# Altium project PulseOxLabView.PrjPcb
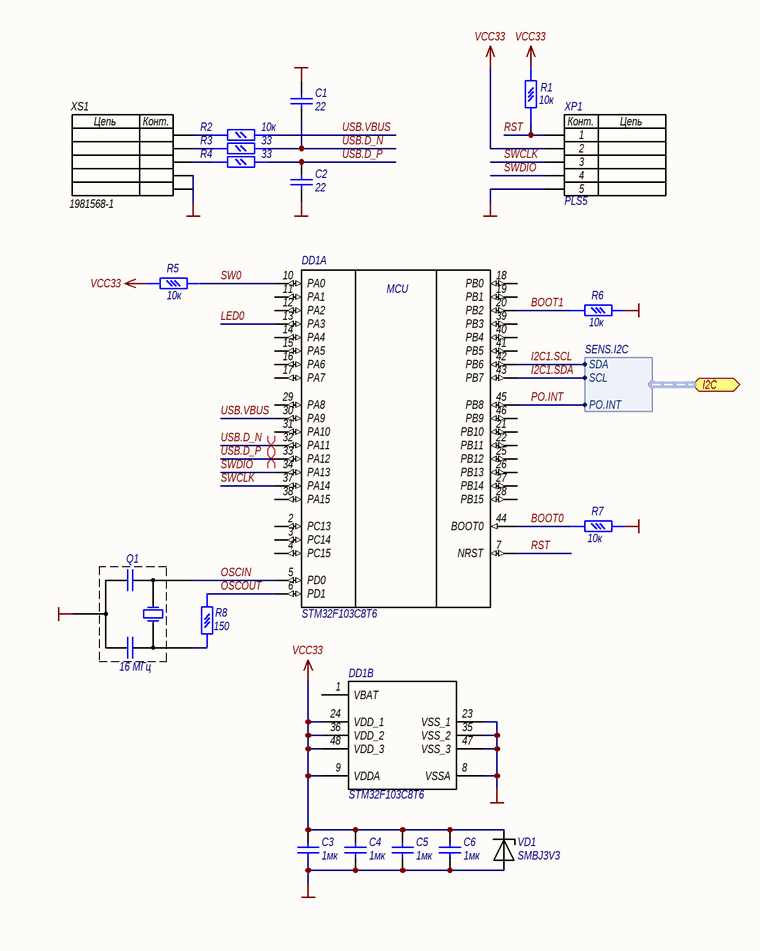
[diagram p0: MCU.SchDoc]
3 sheets, 49 parts. Net scope: flat (ports and power ports of the same name join across sheets).
Sheets:
  MCU.SchDoc
  Power.SchDoc
  Sensors.SchDoc

## Sheet MCU.SchDoc: {Наименование}
size 209 x 297 mm; DocumentNumber: {Обозначение}; SheetNumber: {}; SheetTotal: {}; PageSetup: Record=PageOptions|CenterHorizontal=False|CenterVertical=False|PrintScale=0.99|XCorrection=0.00|YCorrection=0.00|PrintKind=1|BorderSize=5000000|LeftOffset=0|BottomOffset=0|Orientation=1|PaperLength=1000|PaperWidth=1000|Scale=100|PaperSource=15|PrintQuality=600|MediaType=1|DitherType=10|PrintScaleMode=1|PaperKind=A4; Rule: PcbType=ProtelPcb

### Parts
C1  value 22  [CAPC2012L]  (hidden comment: CL21C220JBANNN)
C2  value 22  [CAPC2012L]  (hidden comment: CL21C220JBANNN)
C3  value 1мк  [CAPC1608L]  (hidden comment: CL10A105KO5LNN)
C4  value 1мк  [CAPC1608L]  (hidden comment: CL10A105KO5LNN)
C5  value 1мк  [CAPC1608L]  (hidden comment: CL10A105KO5LNN)
C6  value 1мк  [CAPC1608L]  (hidden comment: CL10A105KO5LNN)
DD1  STM32F103C8T6  [STM-LQFP48_N]  (parts A,B of 2)
Q1  value 16 МГц  [CSTCE_V1]  (hidden comment: CSTCE16M0V53A)
R1  value 10к  [RESC1608L]  (hidden comment: RC1608J103CS)
R2  value 10к  [RESC2012L]  (hidden comment: RC2012J103CS)
R3  value 33  [RESC2012L]  (hidden comment: RC2012J330CS)
R4  value 33  [RESC2012L]  (hidden comment: RC2012J330CS)
R5  value 10к  [RESC1608L]  (hidden comment: RC1608J103CS)
R6  value 10к  [RESC1608L]  (hidden comment: RC1608J103CS)
R7  value 10к  [RESC1608L]  (hidden comment: RC1608J103CS)
R8  value 150  [RESC1608L]  (hidden comment: RC1608J151CS)
VD1  SMBJ3V3  [SMB]
XP1  PLS5  [hdr1x5]
XS1  1981568-1  [1981568]

### Ports
I2C (harness SENS.I2C)

### Harnesses
SENS.I2C: SDA, SCL, PO.INT

### Nets
GND: C1.2 C2.2 C3.1 C4.1 C5.1 C6.1 DD1.8(VSSA) DD1.23(VSS_1) DD1.35(VSS_2) DD1.47(VSS_3) Q1.2(GND) R6.1 R7.1 VD1.2(A) XP1.5 XS1.4 XS1.5
VCC33: C3.2 C4.2 C5.2 C6.2 DD1.9(VDDA) DD1.24(VDD_1) DD1.36(VDD_2) DD1.48(VDD_3) R1.2 R5.1 VD1.1(C) XP1.2
BOOT0: DD1.44(BOOT0) R7.2
BOOT1: DD1.20(PB2) R6.2
I2C1.SCL: DD1.42(PB6) ; port I2C.SDA  [project net I2C.SDA]
I2C1.SDA: DD1.43(PB7) ; port I2C.SCL  [project net I2C.SCL]
LED0: DD1.13(PA3)
OSCIN: DD1.5(PD0) Q1.1(OSC1)
OSCOUT: DD1.6(PD1) R8.2
PO.INT: DD1.45(PB8) ; port I2C.PO.INT
RST: DD1.7(NRST) R1.1 XP1.1
SW0: DD1.10(PA0) R5.2
SWCLK: DD1.37(PA14) XP1.3
SWDIO: DD1.34(PA13) XP1.4
USB.D_N: C1.1 DD1.32(PA11) R3.2
USB.D_P: C2.1 DD1.33(PA12) R4.2
USB.VBUS: DD1.30(PA9) R2.2
NetQ1_3: Q1.3(OSC2) R8.1
NetR2_1: R2.1 XS1.1
NetR3_1: R3.1 XS1.2
NetR4_1: R4.1 XS1.3

Not connected (* = marked no-connect by the designer): DD1 1(VBAT) 2(PC13) 3(PC14) 4(PC15) 11(PA1) 12(PA2) 14(PA4) 15(PA5) 16(PA6) 17(PA7) 18(PB0) 19(PB1) 21(PB10) 22(PB11) 25(PB12) 26(PB13) 27(PB14) 28(PB15) 29(PA8) 31(PA10) 38(PA15) 39(PB3) 40(PB4) 41(PB5) 46(PB9)

### Layout directives
differential pair: USB.D_N, USB.D_P

### Notes on the sheet
- Подп. и дата
- Инв. № дубл.
- Взам. инв. №
- Инв. № подл.
- Лист
- Изм.
- № докум.
- Подп.
- Дата
- (in symbol MICRO USB B) Цепь; Конт.
- (in symbol PLS5) Конт.; Цепь
- (in symbol STM32F103C8T6, part A) MCU

### Library data of the parts
C1 C2 = CL21: Samsung General Capacitor; Power/Voltage: 25В; Rem: SMD; ТКЕ/ТКС: NP0; Tolerance: ±5%; TU/GOST: EIA CC0805; PackageReference: 0805; ManufacturerPartNumber: CL21C220JBANNN; Manufacturer: Samsung; Range: *
C3-C6 = CL10A105KO5LNN: Samsung MLCC Capacitor; Power/Voltage: 16В; Rem: SMD; Tolerance: ±10%; TU/GOST: EIA CC0603; ТКЕ/ТКС: X5R; VAL: 105; Designator: C?; Manufacturer: Samsung; ManufacturerPartNumber: CL10A105KO5LNN; PackageReference: 0603; Range: *; Part Number: CL10A105KO5LNN; Pin Count: 2; Published: 01.05.2013; Publisher: Komiss Labs.
DD1 = STM32F103C8T6: ARM Cortex-M3 32-bit MCU, 64 KB Flash, 20 KB Internal RAM, 37 I/Os, 48-pin LQFP, -40 to 85 degC, Tray; Manufacturer: STMicroelectronics; REM: SMD; ManufacturerPartNumber: STM32F103C8T6; PackageReference: LQFP48
Q1 = CSTCE16M0V53A: Murata Ceramic Resonator; Manufacturer: Murata Manufacturing Co., Ltd.; ManufacturerPartNumber: CSTCE16M0V53A; PackageReference: 3216
R1 R5-R7 = RC1608J103CS: General Thick Film Chip Resistor; Manufacturer: Samsung; Power/Voltage: 0.1Вт; Tolerance: ±5%; Rem: SMD; Check: NO; ТКЕ/ТКС: ±250ppm/°C; TU/GOST: EIA RES0603; Designator: R?; F47: 10000,0; ManufacturerPartNumber: RC1608J103CS; PackageReference: 0603; Name: RC1608J103CS; Type: Резистор; Part Number: RC1608J103CS; Pin Count: 2; Published: 01.05.2013; Publisher: Komiss Labs.
R2-R4 = RES0805: Thick Film Chip Resistor; Manufacturer: Samsung; Power/Voltage: 150В/0.125Вт; Tolerance: ±5%; Rem: SMD; Check: NO; PackageReference: 0805
  R2: ManufacturerPartNumber: RC2012J103CS
  R3 R4: ManufacturerPartNumber: RC2012J330CS
R8 = RC1608J151CS: General Thick Film Chip Resistor; Manufacturer: Samsung; Power/Voltage: 0.1Вт; Tolerance: ±5%; Rem: SMD; Check: NO; ТКЕ/ТКС: ±250ppm/°C; TU/GOST: EIA RES0603; Designator: R?; F47: 150,0; ManufacturerPartNumber: RC1608J151CS; PackageReference: 0603; Name: RC1608J151CS; Type: Резистор; Part Number: RC1608J151CS; Pin Count: 2; Published: 01.05.2013; Publisher: Komiss Labs.
VD1 = SMAJ58A: TVS UNIDIRECT 600W 3.3V SMB; Manufacturer: Diodes Inc; Type: Стабилитрон; ManufacturerPartNumber: SMBJ3V3; PackageReference: SMB(DO-214AA)
XS1 = MICRO USB B: CONN RCPT MICRO USB B R/A SMD; Manufacturer: TE Connectivity; ManufacturerPartNumber: 1981568-1; Type: Розетка

## Sheet Power.SchDoc: {Наименование}
size 209 x 297 mm; DocumentNumber: {Обозначение}; SheetNumber: {}; SheetTotal: {}; PageSetup: Record=PageOptions|CenterHorizontal=False|CenterVertical=False|PrintScale=0.95|XCorrection=0.00|YCorrection=0.00|PrintKind=1|BorderSize=5000000|LeftOffset=0|BottomOffset=0|Orientation=1|PaperLength=1000|PaperWidth=1000|Scale=100|PaperSource=15|PrintQuality=600|MediaType=1|DitherType=10|PaperKind=A4|PrintScaleMode=1; Rule: PcbType=ProtelPcb
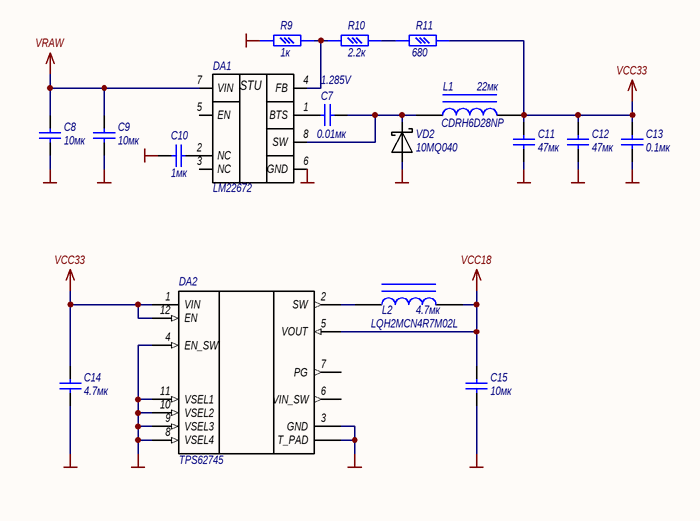
[diagram p1: Power.SchDoc]

### Parts
C7  value 0.01мк  [CAPC3216L]  (hidden comment: CL31B103KBCNNN)
C8  value 10мк  [CAPC3216L]  (hidden comment: CL31A106KBHNNN)
C9  value 10мк  [CAPC3216L]  (hidden comment: CL31A106KBHNNN)
C10  value 1мк  [CAPC1608L]  (hidden comment: CL10A105KA5LNN)
C11  value 47мк  [CAPC3225L]  (hidden comment: CL32A476MQJNNN)
C12  value 47мк  [CAPC3225L]  (hidden comment: CL32A476MQJNNN)
C13  value 0.1мк  [CAPC3216L]  (hidden comment: CL31B104KACNNN)
C14  value 4.7мк  [CAPC1005L]  (hidden comment: CL05A475MQ5NRN)
C15  value 10мк  [CAPC1608L]  (hidden comment: CL10A106MO8NQN)
DA1  LM22672  [MRA08B_N]
DA2  TPS62745  [WSON-12]
L1  CDRH6D28NP  value 22мк  [CDRH6D38]
L2  LQH2MCN4R7M02L  value 4.7мк  [INDUCTOR0806]
R9  value 1к  [RESC1608L]  (hidden comment: RC1608J102CS)
R10  value 2.2к  [RESC1608L]  (hidden comment: RC1608J222CS)
R11  value 680  [RESC1608L]  (hidden comment: RC1608J681CS)
VD2  10MQ040  [SMA_]

### Nets
GND: C8.1 C9.1 C10.1 C11.1 C12.1 C13.1 C14.1 C15.1 DA1.6(GND) DA2.3(GND) DA2.4(EN_SW) DA2.8(VSEL4) DA2.9(VSEL3) DA2.10(VSEL2) DA2.11(VSEL1) DA2.13(T_PAD) R9.1 VD2.1
VCC18: C15.2 DA2.5(VOUT) L2.2
VCC33: C11.2 C12.2 C13.2 C14.2 DA2.1(VIN) DA2.12(EN) L1.2 R11.2
VRAW: C8.2 C9.2 DA1.7(VIN)
NetC7_1: C7.1 DA1.8(SW) L1.1 VD2.2
NetC7_2: C7.2 DA1.1(BTS)
NetC10_2: C10.2 DA1.2(NC)
NetDA1_4: DA1.4(FB) R9.2 R10.1
NetDA2_2: DA2.2(SW) L2.1
NetR10_2: R10.2 R11.1

Not connected (* = marked no-connect by the designer): DA1 3(NC) 5(EN); DA2 6(VIN_SW) 7(PG)

### Notes on the sheet
- 1.285V
- Подп. и дата
- Инв. № дубл.
- Взам. инв. №
- Инв. № подл.
- Лист
- Изм.
- № докум.
- Подп.
- Дата
- (in symbol LM2674MX-XXX) STU

### Library data of the parts
C7 = CL31B103KBCNNN: Samsung MLCC Capacitor; Power/Voltage: 50В; Rem: SMD; Tolerance: ±10%; TU/GOST: EIA CC1206; ТКЕ/ТКС: X7R; VAL: 103; Manufacturer: Samsung; ManufacturerPartNumber: CL31B103KBCNNN; PackageReference: 1206; Range: *; Part Number: CL31B103KBCNNN; Pin Count: 2; Published: 01.05.2013; Publisher: Komiss Labs.
C8 C9 = CL31A106KBHNNN: Samsung MLCC Capacitor; Power/Voltage: 50В; Rem: SMD; Tolerance: ±10%; TU/GOST: EIA CC1206; ТКЕ/ТКС: X5R; VAL: 106; Designator: C?; Manufacturer: Samsung; ManufacturerPartNumber: CL31A106KBHNNN; PackageReference: 1206; Range: *; Part Number: CL31A106KBHNNN; Pin Count: 2; Published: 01.05.2013; Publisher: Komiss Labs.
C10 = CL10A105KA5LNN: Samsung MLCC Capacitor; Power/Voltage: 25В; Rem: SMD; Tolerance: ±10%; TU/GOST: EIA CC0603; ТКЕ/ТКС: X5R; VAL: 105; Designator: C?; Manufacturer: Samsung; ManufacturerPartNumber: CL10A105KA5LNN; PackageReference: 0603; Range: *; Part Number: CL10A105KA5LNN; Pin Count: 2; Published: 01.05.2013; Publisher: Komiss Labs.
C11 C12 = CL32A476MQJNNN: Samsung MLCC Capacitor; Power/Voltage: 6.3В; Rem: SMD; Tolerance: ±20%; TU/GOST: EIA CC1210; ТКЕ/ТКС: X5R; VAL: 476; Manufacturer: Samsung; ManufacturerPartNumber: CL32A476MQJNNN; PackageReference: 1210; Range: *; Part Number: CL32A476MQJNNN; Pin Count: 2; Published: 01.05.2013; Publisher: Komiss Labs.
C13 = CL31B104KACNNN: Samsung MLCC Capacitor; Power/Voltage: 25В; Rem: SMD; Tolerance: ±10%; TU/GOST: EIA CC1206; ТКЕ/ТКС: X7R; VAL: 104; Manufacturer: Samsung; ManufacturerPartNumber: CL31B104KACNNN; PackageReference: 1206; Range: *; Part Number: CL31B104KACNNN; Pin Count: 2; Published: 01.05.2013; Publisher: Komiss Labs.
C14 = CL05A475MQ5NRN: Samsung MLCC Capacitor; Power/Voltage: 6.3В; Rem: SMD; Tolerance: ±20%; TU/GOST: EIA CC0402; ТКЕ/ТКС: X5R; VAL: 475; Designator: C?; Manufacturer: Samsung; ManufacturerPartNumber: CL05A475MQ5NRN; PackageReference: 0402; Range: *; Part Number: CL05A475MQ5NRN; Pin Count: 2; Published: 01.05.2013; Publisher: Komiss Labs.
C15 = CL10A106MO8NQN: Samsung MLCC Capacitor; Power/Voltage: 16В; Rem: SMD; Tolerance: ±20%; TU/GOST: EIA CC0603; ТКЕ/ТКС: X5R; VAL: 106; Designator: C?; Manufacturer: Samsung; ManufacturerPartNumber: CL10A106MO8NQN; PackageReference: 0603; Range: *; Part Number: CL10A106MO8NQN; Pin Count: 2; Published: 01.05.2013; Publisher: Komiss Labs.
DA1 = LM2674MX-XXX: 40 V, 0.5A Simple Switcher, Step-Down; Manufacturer: Texas Instruments; ManufacturerPartnumber: LM22672; packagereference: SOIC-8
DA2 = TPS62745: Dual-cell Ultra Low IQ Step Down Converter for Low Power Wireless  Applications; Manufacturer: Texas Instruments; REM: SMD; ManufacturerPartNumber: TPS62745; PackageReference: WSON-12
L1 = Inductor Iron: Magnetic-Core Inductor; Manufacturer: Sumida; ManufacturerPartNumber: CDRH6D28NP-220NC; Rem: SMD; Tolerance: ±10%; Published: 24-Mar-1999; LatestRevisionDate: 17-Jul-2002; LatestRevisionNote: Re-released for DXP Platform.; PackageReference: AXIAL-0.9; Publisher: Altium Limited
L2 = Inductor Iron: Magnetic-Core Inductor; Manufacturer: Sumida; Rem: SMD; Tolerance: ±10%; Published: 24-Mar-1999; LatestRevisionDate: 17-Jul-2002; LatestRevisionNote: Re-released for DXP Platform.; PackageReference: AXIAL-0.9; Publisher: Altium Limited; ManufacturerPartNumber: LQH2MCN4R7M02L
R9 = RC1608J102CS: General Thick Film Chip Resistor; Manufacturer: Samsung; Power/Voltage: 0.1Вт; Tolerance: ±5%; Rem: SMD; Check: NO; ТКЕ/ТКС: ±250ppm/°C; TU/GOST: EIA RES0603; Designator: R?; F47: 1000,0; ManufacturerPartNumber: RC1608J102CS; PackageReference: 0603; Name: RC1608J102CS; Type: Резистор; Part Number: RC1608J102CS; Pin Count: 2; Published: 01.05.2013; Publisher: Komiss Labs.
R10 = RC1608J222CS: General Thick Film Chip Resistor; Manufacturer: Samsung; Power/Voltage: 0.1Вт; Tolerance: ±5%; Rem: SMD; Check: NO; ТКЕ/ТКС: ±250ppm/°C; TU/GOST: EIA RES0603; Designator: R?; F47: 2200,0; ManufacturerPartNumber: RC1608J222CS; PackageReference: 0603; Name: RC1608J222CS; Type: Резистор; Part Number: RC1608J222CS; Pin Count: 2; Published: 01.05.2013; Publisher: Komiss Labs.
R11 = RC1608J681CS: General Thick Film Chip Resistor; Manufacturer: Samsung; Power/Voltage: 0.1Вт; Tolerance: ±5%; Rem: SMD; Check: NO; ТКЕ/ТКС: ±250ppm/°C; TU/GOST: EIA RES0603; Designator: R?; F47: 680,0; ManufacturerPartNumber: RC1608J681CS; PackageReference: 0603; Name: RC1608J681CS; Type: Резистор; Part Number: RC1608J681CS; Pin Count: 2; Published: 01.05.2013; Publisher: Komiss Labs.
VD2 = 10MQ040: Schottky Barrier Diode; Manufacturer: International Rectifier; PackageReference: SMA(D-64); ManufacturerPartNumber: 10MQ040

## Sheet Sensors.SchDoc: {Наименование}
size 209 x 297 mm; DocumentNumber: {Обозначение}; SheetNumber: {}; SheetTotal: {}; PageSetup: Record=PageOptions|CenterHorizontal=False|CenterVertical=False|PrintScale=0.99|XCorrection=0.00|YCorrection=0.00|PrintKind=2|BorderSize=5000000|LeftOffset=0|BottomOffset=0|Orientation=1|PaperLength=1000|PaperWidth=1000|Scale=100|PaperSource=15|PrintQuality=-3|MediaType=1|DitherType=10|PrintScaleMode=1|PaperKind=A4|PaperIndex=9; Rule: PcbType=ProtelPcb
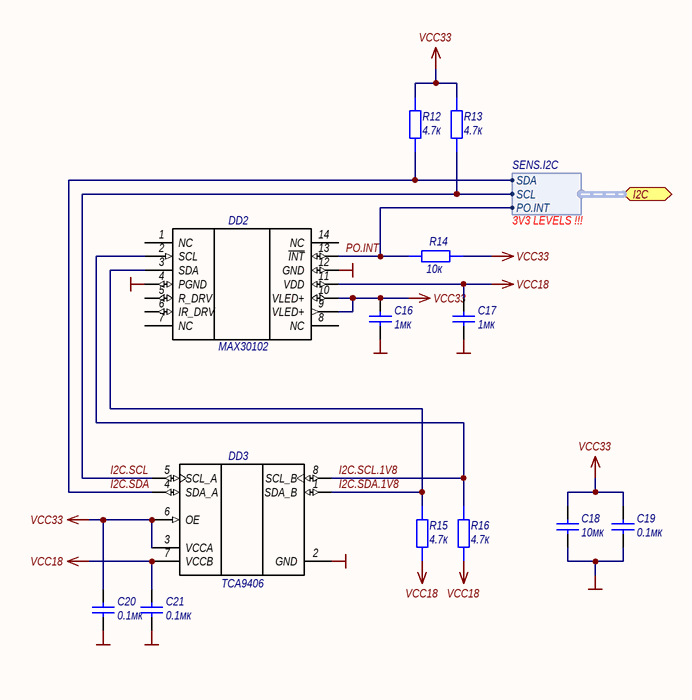
[diagram p2: Sensors.SchDoc]

### Parts
C16  value 1мк  [CAPC1005L]  (hidden comment: CL05A105KQ5NNN)
C17  value 1мк  [CAPC1005L]  (hidden comment: CL05A105KQ5NNN)
C18  value 10мк  [CAPC1005L]  (hidden comment: CL05A106MQ5NUN)
C19  value 0.1мк  [CAPC1005L]  (hidden comment: CL05A104KP5NNN)
C20  value 0.1мк  [CAPC1005L]  (hidden comment: CL05A104KP5NNN)
C21  value 0.1мк  [CAPC1005L]  (hidden comment: CL05A104KP5NNN)
DD2  MAX30102  [MAX30102]
DD3  TCA9406  [DCU8_L]
R12  value 4.7к  [RESC1005L]  (hidden comment: RC1005J472CS)
R13  value 4.7к  [RESC1005L]  (hidden comment: RC1005J472CS)
R14  value 10к  [RESC1005L]  (hidden comment: RC1005J103CS)
R15  value 4.7к  [RESC1005L]  (hidden comment: RC1005J472CS)
R16  value 4.7к  [RESC1005L]  (hidden comment: RC1005J472CS)

### Ports
I2C (harness SENS.I2C)

### Harnesses
SENS.I2C: SDA, SCL, PO.INT

### Nets
GND: C16.1 C17.1 C18.1 C19.1 C20.1 C21.1 DD2.4(PGND) DD2.12(GND) DD3.2(GND)
VCC18: C17.2 C21.2 DD2.11(VDD) DD3.7(VCCB) R15.1 R16.1
VCC33: C16.2 C18.2 C19.2 C20.2 DD2.9(VLED+) DD2.10(VLED+) DD3.3(VCCA) DD3.6(OE) R12.2 R13.2 R14.1
I2C.SCL: DD3.5(SCL_A) R13.1 ; port I2C.SCL
I2C.SCL.1V8: DD2.2(SCL) DD3.8(SCL_B) R16.2
I2C.SDA: DD3.4(SDA_A) R12.1 ; port I2C.SDA
I2C.SDA.1V8: DD2.3(SDA) DD3.1(SDA_B) R15.2
PO.INT: DD2.13(~{INT}) R14.2 ; port I2C.PO.INT

Not connected (* = marked no-connect by the designer): DD2 1(NC) 5(R_DRV) 6(IR_DRV) 7(NC) 8(NC) 14(NC)

### Notes on the sheet
- 3V3 LEVELS !!!
- Подп. и дата
- Инв. № дубл.
- Взам. инв. №
- Инв. № подл.
- Лист
- Изм.
- № докум.
- Подп.
- Дата

### Library data of the parts
C16 C17 = CL05A105KQ5NNN: Samsung MLCC Capacitor; Power/Voltage: 6.3В; Rem: SMD; Tolerance: ±10%; TU/GOST: EIA CC0402; ТКЕ/ТКС: X5R; VAL: 105; Manufacturer: Samsung; ManufacturerPartNumber: CL05A105KQ5NNN; PackageReference: 0402; Range: *; Part Number: CL05A105KQ5NNN; Pin Count: 2; Published: 01.05.2013; Publisher: Komiss Labs.
C18 = CL05A106MQ5NUN: Samsung MLCC Capacitor; Power/Voltage: 6.3В; Rem: SMD; Tolerance: ±20%; TU/GOST: EIA CC0402; ТКЕ/ТКС: X5R; VAL: 106; Manufacturer: Samsung; ManufacturerPartNumber: CL05A106MQ5NUN; PackageReference: 0402; Range: *; Part Number: CL05A106MQ5NUN; Pin Count: 2; Published: 01.05.2013; Publisher: Komiss Labs.
C19-C21 = CL05A104KP5NNN: Samsung MLCC Capacitor; Power/Voltage: 10В; Rem: SMD; Tolerance: ±10%; TU/GOST: EIA CC0402; ТКЕ/ТКС: X5R; VAL: 104; Manufacturer: Samsung; ManufacturerPartNumber: CL05A104KP5NNN; PackageReference: 0402; Range: *; Part Number: CL05A104KP5NNN; Pin Count: 2; Published: 01.05.2013; Publisher: Komiss Labs.
DD2 = MAX30102: High-Sensitivity Pulse Oximeter and  Heart-Rate Sensor for Wearable Health; Manufacturer: MAXIM Integrated; REM: SMD; ManufacturerPartNumber: MAX30102; PackageReference: LGA-14
DD3 = TCA9406: TCA9406 Dual Bidirectional 1-MHz I2C-BUS and SMBus Voltage Level-Translator, 1.65 to 3.6 V, -40 to 85 degC, 8-pin US8 (DCU), Green (RoHS & no Sb/Br); Manufacturer: Texas Instruments; REM: SMD; ManufacturerPartNumber: TCA9406; PackageReference: TSSOP-8
R12 R13 R15 R16 = RC1005J472CS: General Thick Film Chip Resistor; Manufacturer: Samsung; Power/Voltage: 0.063Вт; Tolerance: ±5%; Rem: SMD; Check: NO; TU/GOST: EIA RES0402; ТКЕ/ТКС: ±100ppm/°C; Designator: R?; F47: 4700,0; ManufacturerPartNumber: RC1005J472CS; PackageReference: 0402; Part Number: RC1005J472CS; Pin Count: 2; Published: 01.05.2013; Publisher: Komiss Labs.
R14 = RC1005J103CS: General Thick Film Chip Resistor; Manufacturer: Samsung; Power/Voltage: 0.063Вт; Tolerance: ±5%; Rem: SMD; Check: NO; TU/GOST: EIA RES0402; ТКЕ/ТКС: ±100ppm/°C; F47: 10000,0; ManufacturerPartNumber: RC1005J103CS; PackageReference: 0402; Part Number: RC1005J103CS; Pin Count: 2; Published: 01.05.2013; Publisher: Komiss Labs.

## Nets that join several sheets
GND: MCU (17 pins), Power (18 pins), Sensors (9 pins)
VCC18: Power (C15.2 DA2.5 L2.2), Sensors (6 pins)
VCC33: MCU (12 pins), Power (8 pins), Sensors (11 pins)
I2C.SCL: MCU (DD1.43), Sensors (DD3.5 R13.1)
I2C.SDA: MCU (DD1.42), Sensors (DD3.4 R12.1)
PO.INT: MCU (DD1.45), Sensors (DD2.13 R14.2)